# EasyEDA schematic SCH_Flight-Computer_2024-07-14.json
TITLE: Flight Computer Schematic; REV: 1.0; Date: 2024-07-14; Sheet: 1/1; Drawn By: usedgenes; Company: Your Company
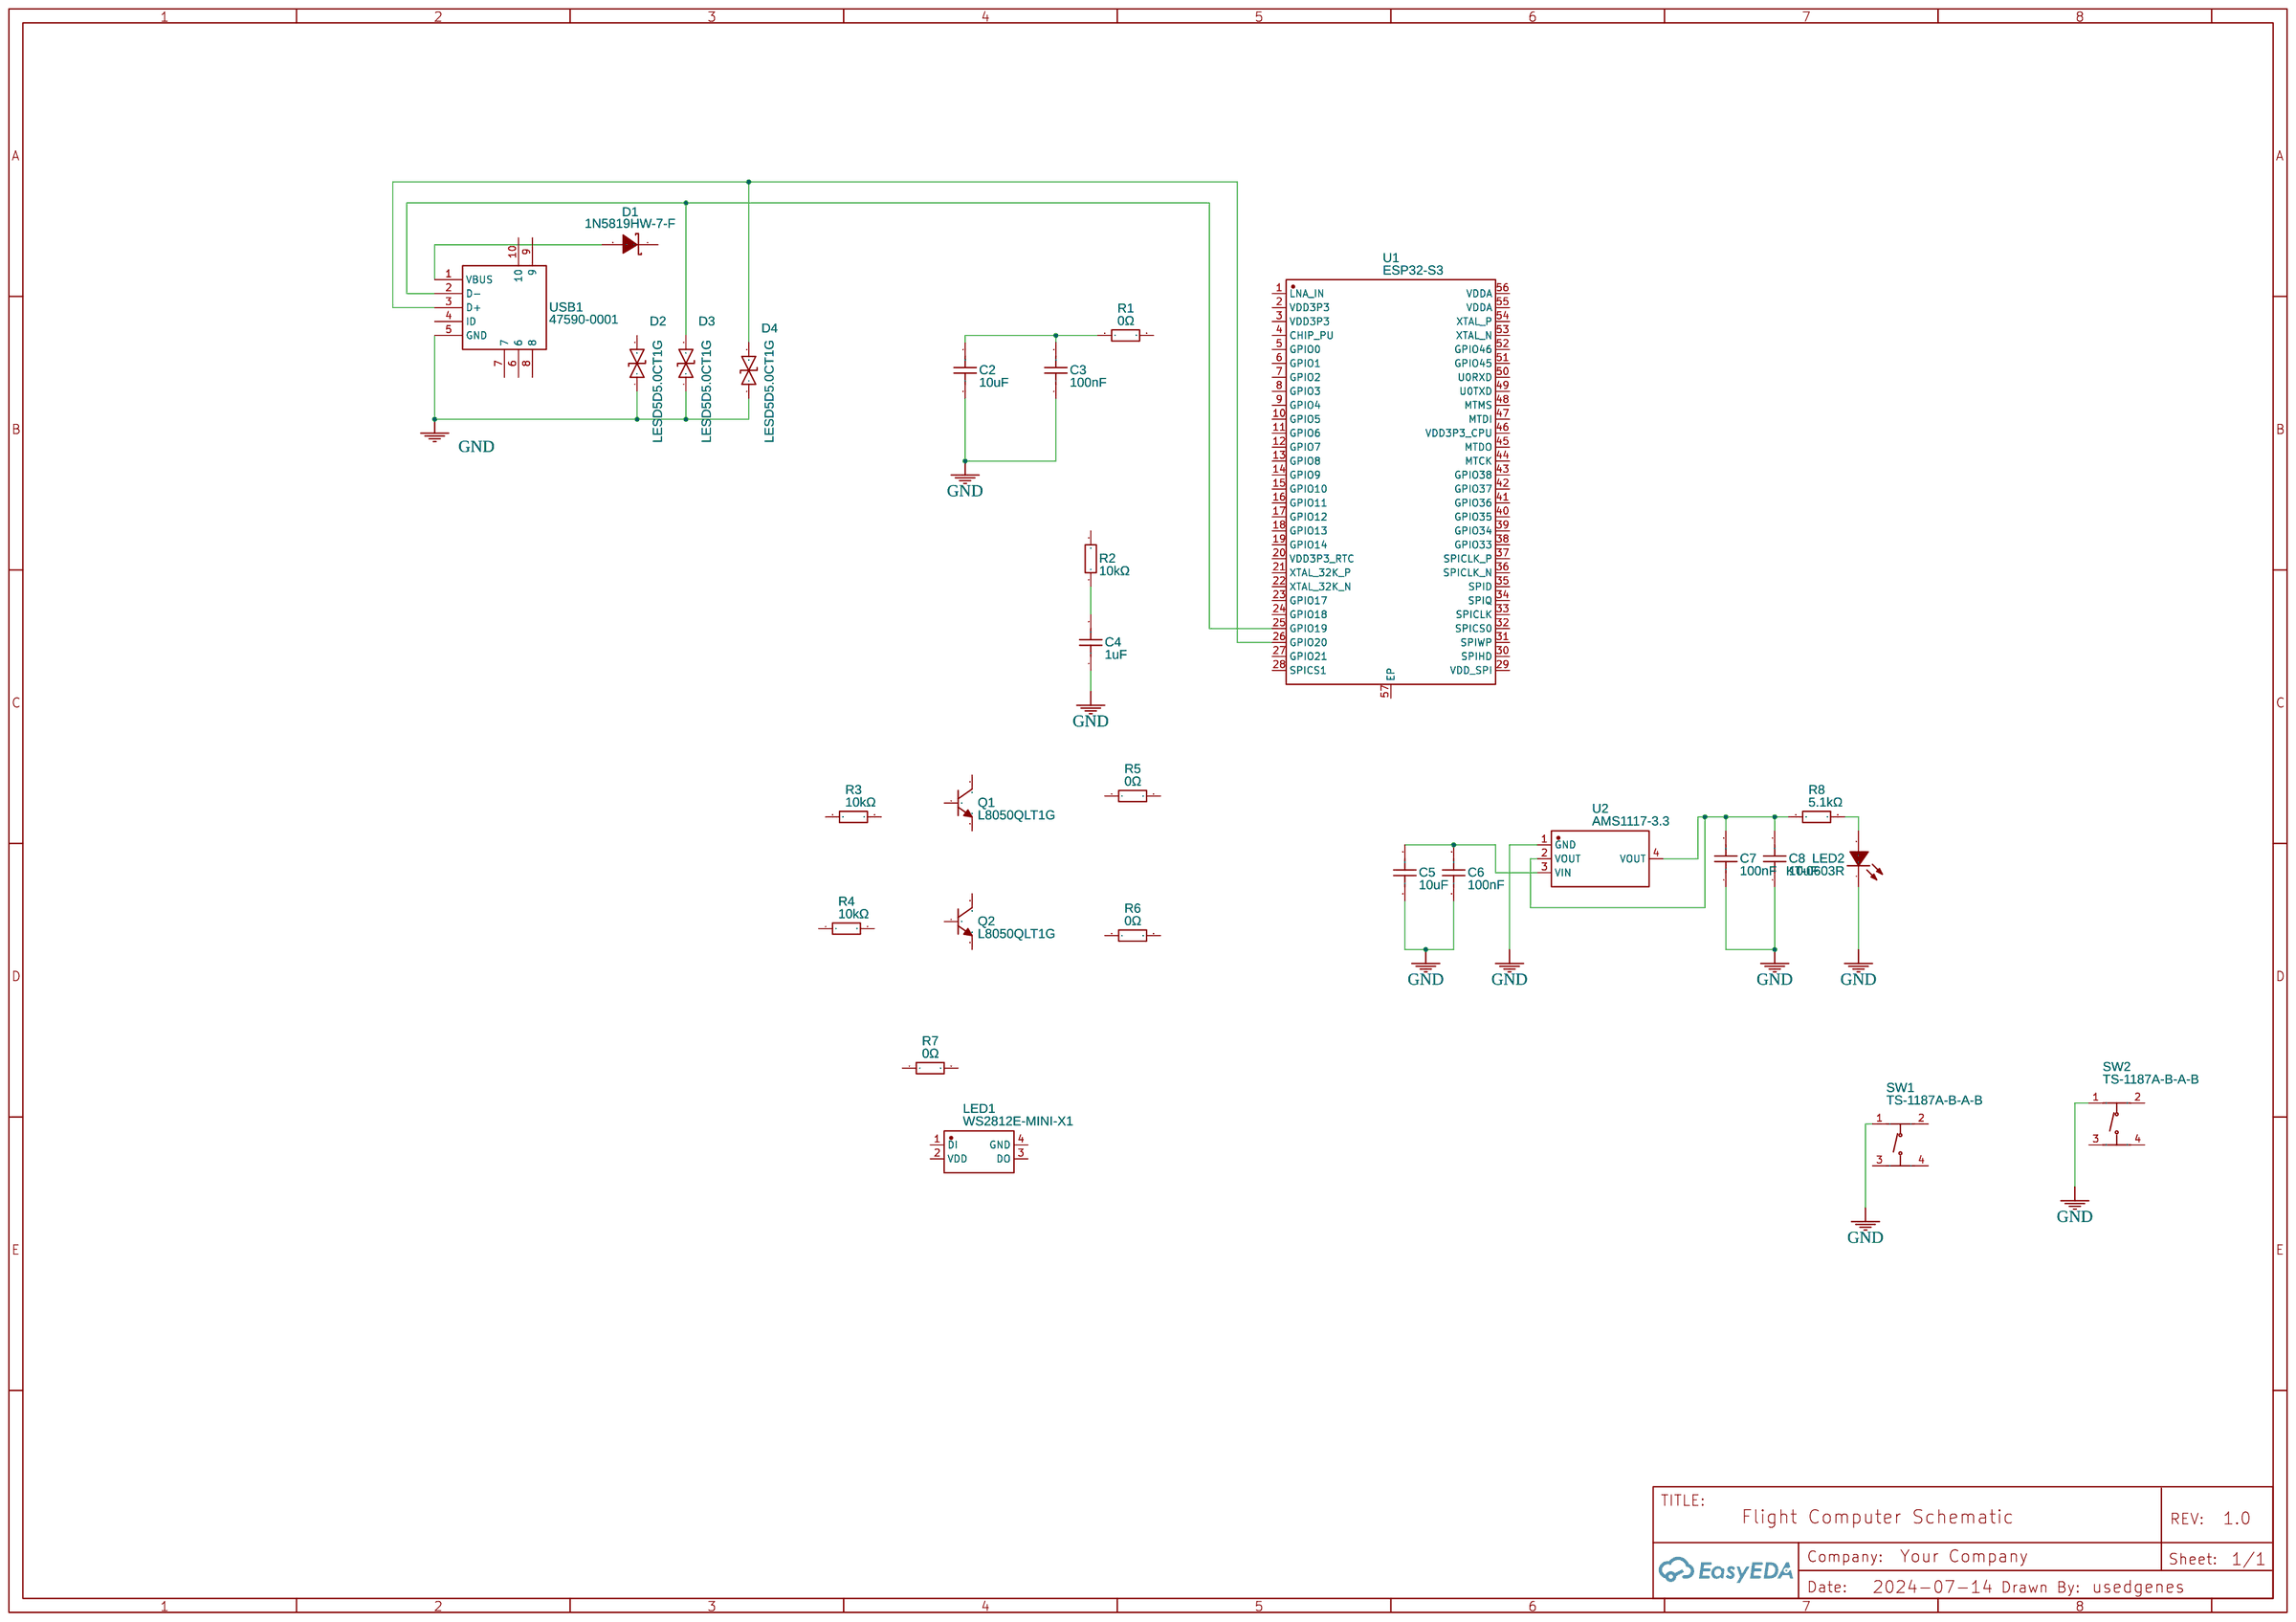
[diagram p0: schematic sheet]

## Parts
C2  10uF  [C0603]
C3  100nF  [C0603]
C4  1uF  [C0603]
C5  10uF  [C0603]
C6  100nF  [C0603]
C7  100nF  [C0603]
C8  10uF  [C0603]
D1  1N5819HW-7-F  [SOD-123_L2.7-W1.6-LS3.7-RD]
D2  LESD5D5.0CT1G  [SOD-523_L1.2-W0.8-LS1.6-BI]
D3  LESD5D5.0CT1G  [SOD-523_L1.2-W0.8-LS1.6-BI]
D4  LESD5D5.0CT1G  [SOD-523_L1.2-W0.8-LS1.6-BI]
LED1  WS2812E-MINI-X1  [LED-SMD_4P-L3.7-W3.5-P1.75-BR-SK6812MINI]
LED2  KT-0603R  [LED0603-RD]
Q1  L8050QLT1G  [SOT-23-3_L2.9-W1.3-P1.90-LS2.4-BR]
Q2  L8050QLT1G  [SOT-23-3_L2.9-W1.3-P1.90-LS2.4-BR]
R1  0Ω  [R0402]
R2  10kΩ  [R0603]
R3  10kΩ  [R0603]
R4  10kΩ  [R0603]
R5  0Ω  [R0402]
R6  0Ω  [R0402]
R7  0Ω  [R0402]
R8  5.1kΩ  [R0603]
SW1  TS-1187A-B-A-B  [SW-SMD_4P-L5.1-W5.1-P3.70-LS6.5-TL-2]
SW2  TS-1187A-B-A-B  [SW-SMD_4P-L5.1-W5.1-P3.70-LS6.5-TL-2]
U1  ESP32-S3  [QFN-56_L7.0-W7.0-P0.40-TL-EP4.0]
U2  AMS1117-3.3  [SOT-223-3_L6.5-W3.4-P2.30-LS7.0-BR]
USB1  47590-0001  [MICRO-USB-SMD_47590-0001]

## Library data of the parts
C2 C5 C8 = CL10A106KP8NNNC: Supplier: LCSC; Manufacturer: SAMSUNG(三星); Supplier Part: C19702; JLCPCB Part Class: Basic Part
C3 C6 C7 = CC0603KRX7R9BB104: Supplier: LCSC; Manufacturer: YAGEO(国巨); Supplier Part: C14663; JLCPCB Part Class: Basic Part
C4 = CL10A105KB8NNNC: Supplier: LCSC; Manufacturer: SAMSUNG(三星); Supplier Part: C15849; JLCPCB Part Class: Basic Part; link: https://lcsc.com/eda_search?q=C15849&%26type=1&ref=editor
D1 = 1N5819HW-7-F: Supplier: LCSC; Manufacturer: DIODES(美台); Supplier Part: C82544; JLCPCB Part Class: Extended Part
D2-D4 = LESD5D5.0CT1G: Contributor: LCSC; Supplier: LCSC; Supplier Part: C383211; Manufacturer: LRC(乐山无线电); JLCPCB Part Class: Extended Part
LED1 = WS2812E-MINI-X1: Contributor: lcsc; Supplier: LCSC; Supplier Part: C4154871; Manufacturer: worldsemi; JLCPCB Part Class: Extended Part
LED2 = KT-0603R: Supplier: LCSC; Manufacturer: KENTO; Supplier Part: C2286; JLCPCB Part Class: Basic Part
Q1 Q2 = L8050QLT1G: Supplier: LCSC; Manufacturer: LRC(乐山无线电); Supplier Part: C49581; JLCPCB Part Class: Extended Part
R1 R5-R7 = 0402WGF0000TCE: Supplier: LCSC; Manufacturer: UNI-ROYAL(厚声); Supplier Part: C17168; JLCPCB Part Class: Basic Part
R2-R4 = 0603WAF1002T5E: Supplier: LCSC; Manufacturer: UNI-ROYAL(厚声); Supplier Part: C25804; JLCPCB Part Class: Basic Part
R8 = 0603WAF5101T5E: Supplier: LCSC; Manufacturer: UNI-ROYAL(厚声); Supplier Part: C23186; JLCPCB Part Class: Basic Part
SW1 SW2 = TS-1187A-B-A-B: Contributor: LCSC; Supplier: LCSC; Supplier Part: C318884; Manufacturer: XKB Connectivity(中国星坤); JLCPCB Part Class: Basic Part
U1 = ESP32-S3: Contributor: LCSC; Supplier: LCSC; Supplier Part: C2913192; Manufacturer: ESPRESSIF(乐鑫); JLCPCB Part Class: Extended Part
U2 = AMS1117-3.3: sourceId: dwIGgezVh; Supplier: LCSC; Manufacturer: AMS; Supplier Part: C6186; JLCPCB Part Class: Basic Part
USB1 = 47590-0001: Contributor: LCSC; Supplier: LCSC; Manufacturer: MOLEX; Manufacturer Part: 475900001; Supplier Part: C136001; JLCPCB Part Class: Extended Part

## Nets
GND: C2.2 C3.1 C4.1 C5.1 C6.1 C7.1 C8.1 D2.1 D3.1 D4.1 LED2.1(K) SW1.1(A) SW2.1(A) U2.1(GND) USB1.5(GND)
Net-(C2-1): C2.1 C3.2 R1.1
Net-(C4-2): C4.2 R2.1
Net-(C5-2): C5.2 C6.2 U2.3(VIN)
Net-(C7-2): C7.2 C8.2 R8.1 U2.2(VOUT) U2.4(VOUT)
Net-(D1-2): D1.2(A) USB1.1(VBUS)
Net-(D3-2): D3.2 U1.25(GPIO19) USB1.2(D-)
Net-(D4-2): D4.2 U1.26(GPIO20) USB1.3(D+)
Net-(LED2-2): LED2.2(A) R8.2

Not connected (* = marked no-connect by the designer): D1 1(K); D2 2; LED1 1(DI) 2(VDD) 3(DO) 4(GND); Q1 1(B) 2(E) 3(C); Q2 1(B) 2(E) 3(C); R1 2; R2 2; R3 1 2; R4 1 2; R5 1 2; R6 1 2; R7 1 2; SW1 2(B) 3(C) 4(D); SW2 2(B) 3(C) 4(D); U1 1(LNA_IN) 2(VDD3P3) 3(VDD3P3) 4(CHIP_PU) 5(GPIO0) 6(GPIO1) 7(GPIO2) 8(GPIO3) 9(GPIO4) 10(GPIO5) 11(GPIO6) 12(GPIO7) 13(GPIO8) 14(GPIO9) 15(GPIO10) 16(GPIO11) 17(GPIO12) 18(GPIO13) 19(GPIO14) 20(VDD3P3_RTC) 21(XTAL_32K_P) 22(XTAL_32K_N) 23(GPIO17) 24(GPIO18) 27(GPIO21) 28(SPICS1) 29(VDD_SPI) 30(SPIHD) 31(SPIWP) 32(SPICS0) 33(SPICLK) 34(SPIQ) 35(SPID) 36(SPICLK_N) 37(SPICLK_P) 38(GPIO33) 39(GPIO34) 40(GPIO35) 41(GPIO36) 42(GPIO37) 43(GPIO38) 44(MTCK) 45(MTDO) 46(VDD3P3_CPU) 47(MTDI) 48(MTMS) 49(U0TXD) 50(U0RXD) 51(GPIO45) 52(GPIO46) 53(XTAL_N) 54(XTAL_P) 55(VDDA) 56(VDDA) 57(EP); USB1 4(ID) 6 7 8 9 10
